# EAGLE board BEP32_6stencil_Seed_wMilling (EAGLE 6.4), part 1 of 8
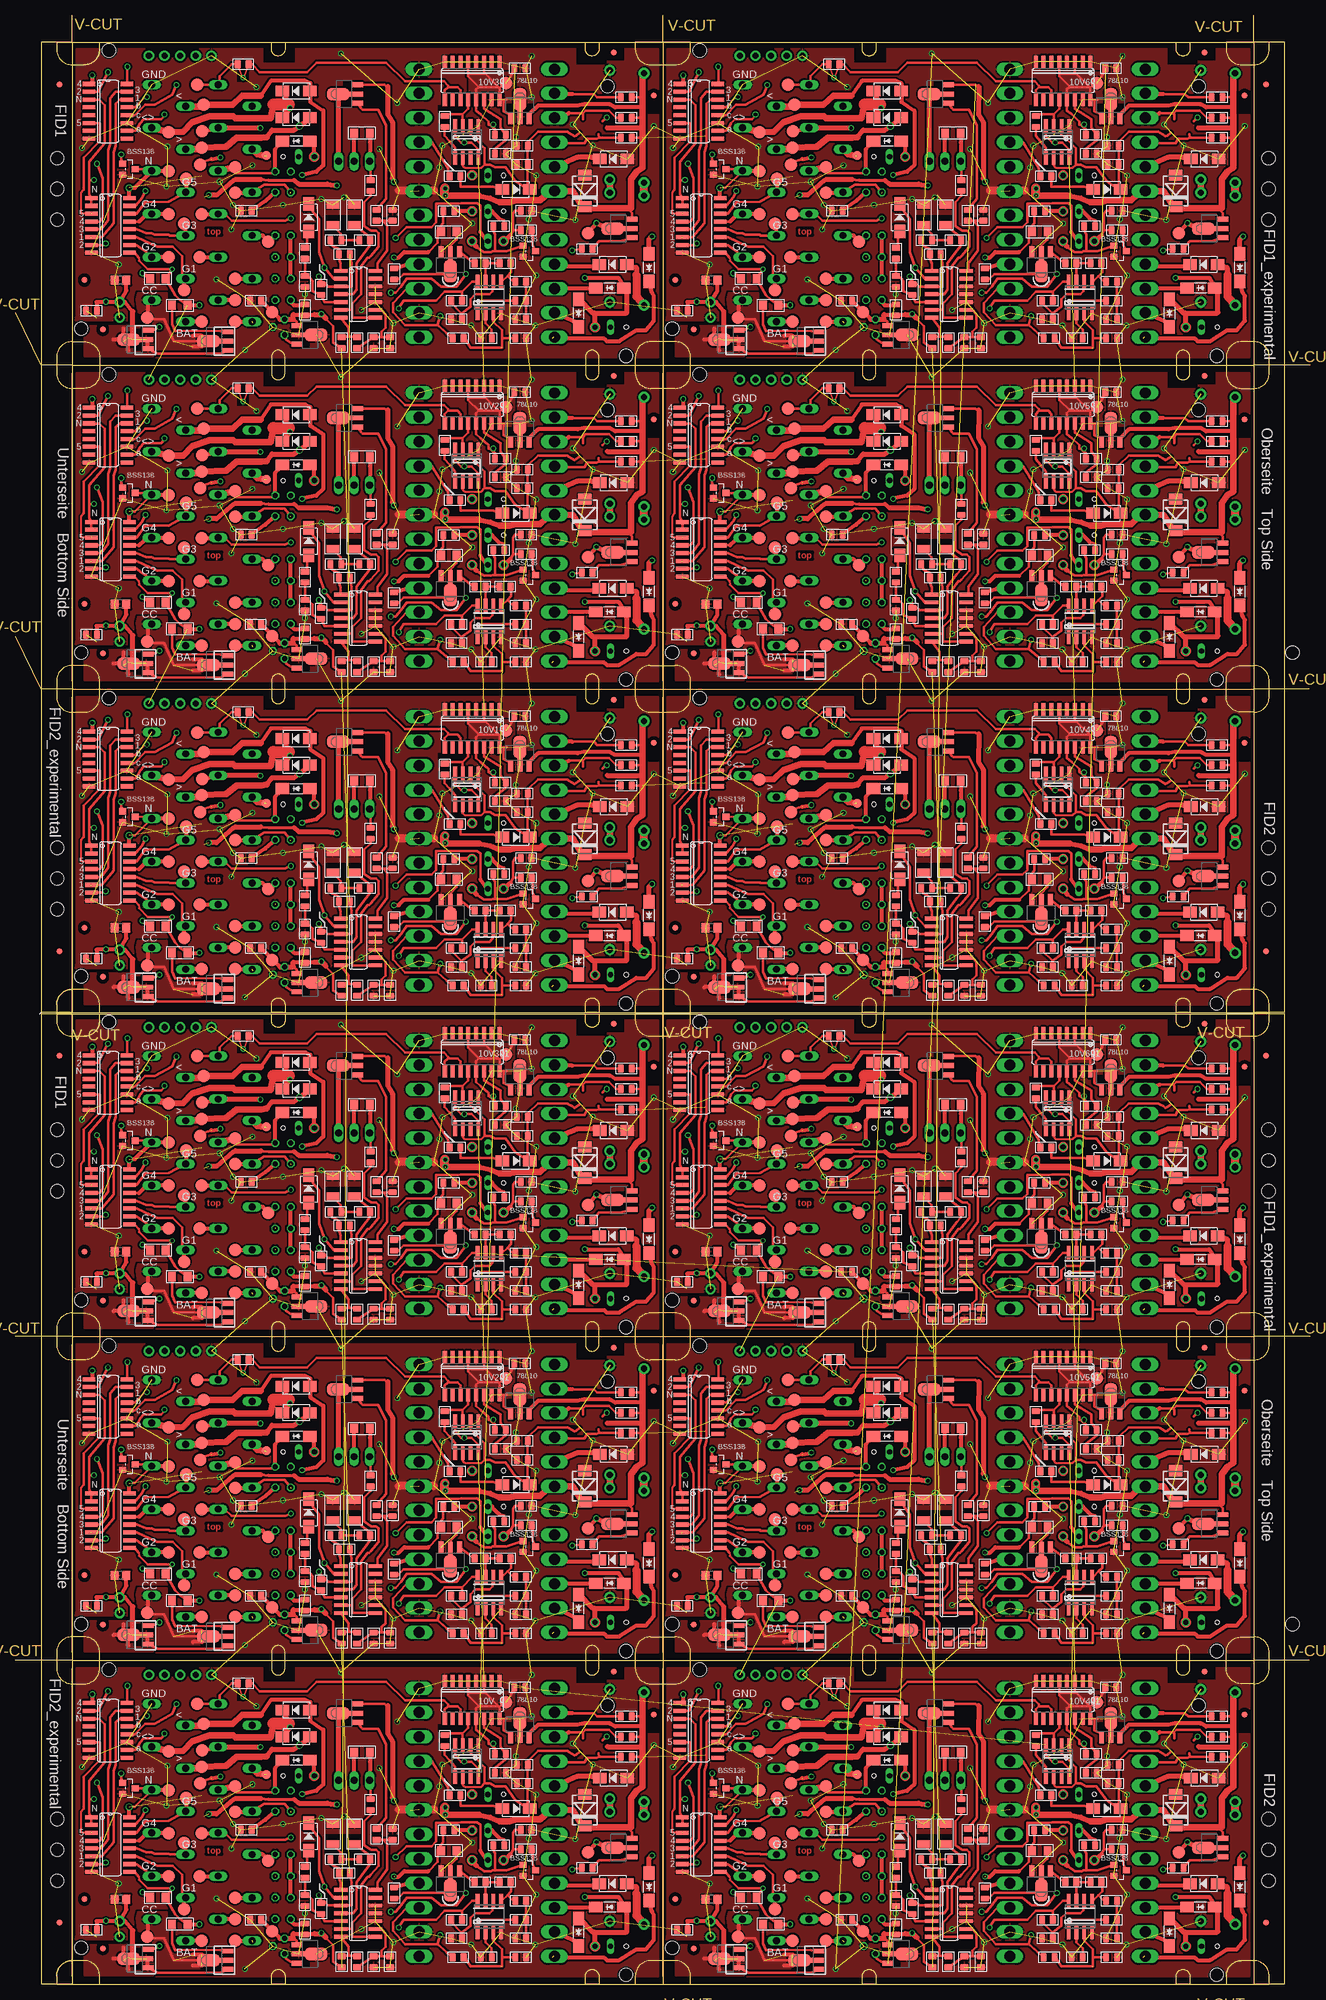
[diagram p24: board, top side]
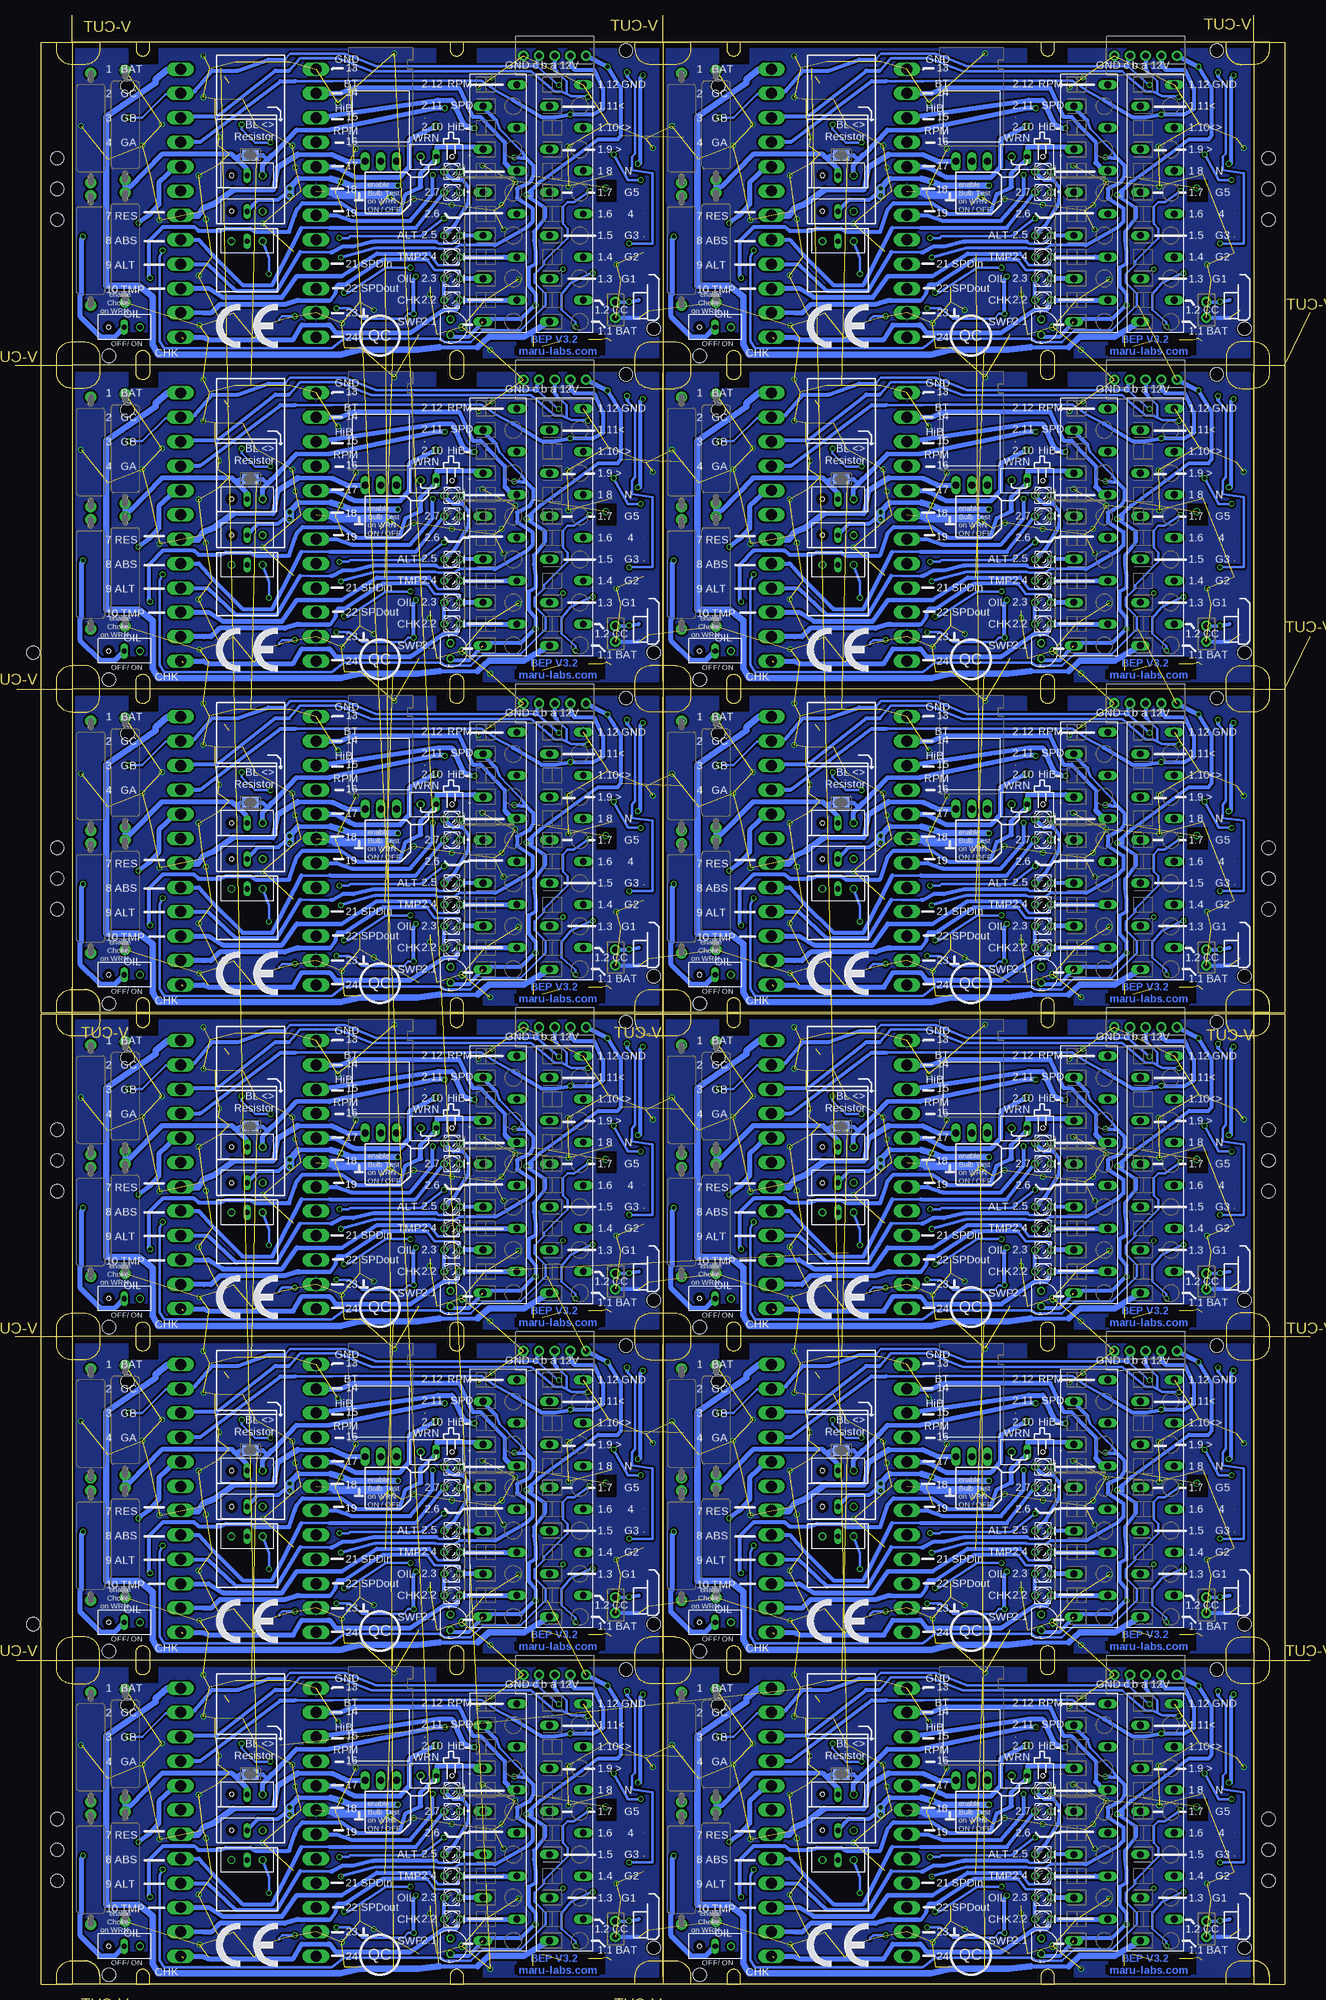
[diagram p25: board, bottom side, seen from below]

Size 210.4 x 319.8 mm. Coordinates in mm from the lower left corner, seen from the top.
Outline: 87 segments
Copper layers (1*16): Top 0.035mm / dielectric 1.5mm / Bottom 0.035mm
Design rules "Vorlage BEP3 und hoeher multi-cb_035um-cu": minimum track width 6mil, minimum drill 12mil, track to track 12mil, track to pad 12mil, pad to pad 6mil, via to via 6mil, smd to smd 6mil, copper to edge 10mil, drill to drill 8mil, minimum pad ring 8mil, minimum via ring 6mil, stop-mask expansion 3mil, vias tented up to drill 0mil, thermal gap 8mil
Holes 2.18 mm at 10.7,5.9 96.2,45.3 10.7,58.5 96.2,97.9 10.7,111.1 96.2,150.5 106.7,5.9 192.2,45.3 106.7,58.5 192.2,97.9 106.7,111.1 192.2,150.5 195.2,1.5 111.2,51.1 99.2,1.5 15.2,51.1 99.2,54.1 195.2,54.1 111.2,103.7 15.2,103.7 99.2,106.7 15.2,156.3 111.2,156.3 195.2,106.7 6.8,138.8 6.8,16.8 6.8,21.8 6.8,133.8 207.5,58.5 203.6,138.8 203.6,16.8 203.6,21.8 203.6,133.8 6.8,26.8 6.8,128.8 203.6,128.8 203.6,26.8 10.7,163.7 96.2,203.1 10.7,216.3 96.2,255.7 10.7,268.9 96.2,308.3 106.7,163.7 192.2,203.1 106.7,216.3 192.2,255.7 106.7,268.9 192.2,308.3 195.2,159.3 111.2,208.9 99.2,159.3 15.2,208.9 99.2,211.9 195.2,211.9 111.2,261.5 15.2,261.5 99.2,264.5 15.2,314.1 111.2,314.1 195.2,264.5 6.8,296.6 6.8,174.6 6.8,179.6 6.8,291.6 207.5,216.3 203.6,296.6 203.6,174.6 203.6,179.6 203.6,291.6 6.8,184.6 6.8,286.6 203.6,286.6 203.6,184.6
tRestrict: area 50.2,21 to 56.7,24.3; area 36,46 to 37.9,47.3; area 67.6,16.6 to 69.4,18.6; area 53.3,41.9 to 54.7,46.2; area 46.5,2.7 to 47.8,7.2; area 47.8,5.9 to 50.5,7.1; area 19.2,2.4 to 20.6,5.9; area 79.5,41.2 to 84.2,42.5; area 97.6,22.4 to 99.2,23.6; area 90.3,38 to 91.4,38.2; area 102.7,40.8 to 104.6,43; area 95.6,49.5 to 98.9,52.2; 168 more areas
bRestrict: area 18.6,1.6 to 28.8,5.1; area 28.7,1.6 to 33.3,3.1; area 38.5,0.9 to 45,3.1; area 39.5,49.1 to 46,51.5; area 90.8,1.5 to 96.8,5.3; area 16.7,26.5 to 20,30.1; area 91.2,48.9 to 96,51.9; area 18.6,54.2 to 28.8,57.8; area 28.7,54.2 to 33.3,55.7; area 38.5,53.5 to 45,55.7; area 39.5,101.7 to 46,104.1; area 90.8,54.1 to 96.8,57.9; 72 more areas
Milling: 360 lines

## Footprints (pad centres in the part's own frame; a part is rotated, then mirrored left to right if it is on the bottom)
12-PIN = drill 1.118 long: 1 19.25,-2.45; 2 15.75,3.05; 3 12.25,-2.45; 4 8.75,3.05; 5 5.25,-2.45; 6 1.75,3.05; 7 -1.75,-2.45; 8 -5.25,3.05; 9 -8.75,-2.45; 10 -12.25,3.05; 11 -15.75,-2.45; 12 -19.25,3.05
B2.0 = smd 2 x 2: TP 0,0
C1206 = smd 1.27 x 2.032: 1 -1.651,0; 2 1.651,0
C0805 = smd 1.397 x 1.016: 1 0,0.889; 2 0,-0.889
DO-214AC = smd 2.2 x 1.77: 1 -2.242,0; 2 2.242,0
DO-214AC_SLIM = smd 2.2 x 1.77: 1 -2.242,0; 2 2.242,0
DO214AA = smd 1.8 x 2.2: A 2.55,0; C -2.55,0
FIDUCIAL_1MM = smd 1 x 1: 1 0,0
FIDUCIAL_1MM_WITH_SOLDERMASK = smd 1 x 1: 1 0,0
SO16 = smd 0.66 x 2.032: 1 -4.445,-3.073; 2 -3.175,-3.073; 3 -1.905,-3.073; 4 -0.635,-3.073; 5 0.635,-3.073; 6 1.905,-3.073; 7 3.175,-3.073; 8 4.445,-3.073; 9 4.445,3.073; 10 3.175,3.073; 11 1.905,3.073; 12 0.635,3.073; 13 -0.635,3.073; 14 -1.905,3.073; 15 -3.175,3.073; 16 -4.445,3.073
78LXX = drill 0.813 octagon: GND 0,1.905; IN 1.27,0; OUT -1.27,0
TO220H_NOHOLE = drill 1.118 long: 1 -2.54,-10.16; 2 0,-10.16; 3 2.54,-10.16
SO14 = smd 0.6 x 2.2: 1 -3.81,-2.8; 2 -2.54,-2.8; 3 -1.27,-2.8; 4 0,-2.8; 5 1.27,-2.8; 6 2.54,-2.8; 7 3.81,-2.8; 8 3.81,2.8; 9 2.54,2.8; 10 1.27,2.8; 11 0,2.8; 12 -1.27,2.8; 13 -2.54,2.8; 14 -3.81,2.8
SOT89_ROUND = smd 0.8 x 1.8: 1 -1.499,-2.181; 3 1.499,-2.181 | smd 0.8 x 2.3: 2 0,-1.927 | smd 2.032 x 3.65: 2@1 0,0.94
SO08 = smd 0.6 x 2.2: 1 -1.905,-2.6; 2 -0.635,-2.6; 3 0.635,-2.6; 4 1.905,-2.6; 5 1.905,2.6; 6 0.635,2.6; 7 -0.635,2.6; 8 -1.905,2.6
JP2_SMALLPADS = drill 0.85: 1 -2.54,0 | drill 0.85 long: 2 0,0 | hole 0.7: 2.54,0
JP2_ORIG_SMALLPADS = drill 0.85: 1 -2.54,0; 3 2.54,0 | drill 0.85 long: 2 0,0
LD260 = drill 0.813 octagon: A -1.27,0; K 1.27,0
SOT89 = smd 0.8 x 1.8: 1 -1.499,-2.181; 3 1.499,-2.181 | smd 0.8 x 2.3: 2 0,-1.927 | smd 2.032 x 3.65: 2@1 0,0.94
SOT-23 = smd 1.016 x 1.143: 1 -0.889,-1.016; 2 0.889,-1.016; 3 0,1.016
V235/17_1MM = drill 1 pad 1.778: 1 -8.89,0; 2 8.89,0
R1206 = smd 1.27 x 1.524: 1 -1.27,0; 2 1.27,0
R0805 = smd 1.397 x 1.016: 1 0,0.889; 2 0,-0.889
R0805' = smd 1.3 x 1.5: 1 -0.95,0; 2 0.95,0
SJ = smd 1.2 x 1.6: 1 -0.725,0; 2 0.725,0
B1,27 = smd 1.5 x 1.5: TP 0,0
24-PIN_V2 = drill 1.778 long: 1 -21.78,-11; 2 -17.82,-11; 3 -13.86,-11; 4 -9.9,-11; 5 -5.94,-11; 6 -1.98,-11; 7 1.98,-11; 8 5.94,-11; 9 9.9,-11; 10 13.86,-11; 11 17.82,-11; 12 21.78,-11; 13 -21.78,11; 14 -17.82,11; 15 -13.86,11; 16 -9.9,11; 17 -5.94,11; 18 -1.98,11; 19 1.98,11; 20 5.94,11; 21 9.9,11; 22 13.86,11; 23 17.82,11; 24 21.78,11
22-23-2051 = drill 1 pad 1.676: 1 -5.08,0; 2 -2.54,0; 3 0,0; 4 2.54,0; 5 5.08,0
22-23-2021 = drill 1 pad 1.676: 1 -1.27,0; 2 1.27,0

## Placement (x,y rotation side)
1  [12-PIN]  25.19,26.3 270 bottom
2  [12-PIN]  35.98,26.3 270 bottom
3  [12-PIN]  25.19,78.9 270 bottom
4  [12-PIN]  35.98,78.9 270 bottom
5  [12-PIN]  25.19,131.5 270 bottom
6  [12-PIN]  35.98,131.5 270 bottom
6V  TPSB2.0  [B2.0]  41.7,8.58 0 top
6V1  TPSB2.0  [B2.0]  41.7,166.38 0 top
6V2  TPSB2.0  [B2.0]  41.7,218.98 0 top
6V3  TPSB2.0  [B2.0]  41.7,271.58 0 top
6V4  TPSB2.0  [B2.0]  137.7,166.38 0 top
6V5  TPSB2.0  [B2.0]  137.7,218.98 0 top
6V6  TPSB2.0  [B2.0]  137.7,271.58 0 top
6V201  TPSB2.0  [B2.0]  41.7,61.18 0 top
6V301  TPSB2.0  [B2.0]  41.7,113.78 0 top
6V401  TPSB2.0  [B2.0]  137.7,8.58 0 top
6V501  TPSB2.0  [B2.0]  137.7,61.18 0 top
6V601  TPSB2.0  [B2.0]  137.7,113.78 0 top
7  [12-PIN]  25.19,184.1 270 bottom
8  [12-PIN]  35.98,184.1 270 bottom
9  [12-PIN]  25.19,236.7 270 bottom
10  [12-PIN]  35.98,236.7 270 bottom
10V  TPSB2.0  [B2.0]  79.7,45.8 0 top
10V1  TPSB2.0  [B2.0]  79.7,203.6 0 top
10V2  TPSB2.0  [B2.0]  79.7,256.2 0 top
10V3  TPSB2.0  [B2.0]  79.7,308.8 0 top
10V4  TPSB2.0  [B2.0]  175.7,203.6 0 top
10V5  TPSB2.0  [B2.0]  175.7,256.2 0 top
10V6  TPSB2.0  [B2.0]  175.7,308.8 0 top
10V201  TPSB2.0  [B2.0]  79.7,98.4 0 top
10V301  TPSB2.0  [B2.0]  79.7,151 0 top
10V401  TPSB2.0  [B2.0]  175.7,45.8 0 top
10V501  TPSB2.0  [B2.0]  175.7,98.4 0 top
10V601  TPSB2.0  [B2.0]  175.7,151 0 top
11  [12-PIN]  25.19,289.3 270 bottom
12  [12-PIN]  35.98,289.3 270 bottom
13  [12-PIN]  121.19,26.3 270 bottom
14  [12-PIN]  131.98,26.3 270 bottom
15  [12-PIN]  121.19,78.9 270 bottom
16  [12-PIN]  131.98,78.9 270 bottom
17  [12-PIN]  121.19,131.5 270 bottom
18  [12-PIN]  131.98,131.5 270 bottom
19  [12-PIN]  121.19,184.1 270 bottom
20  [12-PIN]  131.98,184.1 270 bottom
21  [12-PIN]  121.19,236.7 270 bottom
22  [12-PIN]  131.98,236.7 270 bottom
23  [12-PIN]  121.19,289.3 270 bottom
24  [12-PIN]  131.98,289.3 270 bottom
C1  100u  [C1206]  51.54,182.19 90 top
C2  100u  [C1206]  55.1,182.19 90 top
C3  100nF,  [C0805]  39.03,168.28 270 top
C4  4.7u  [C0805]  82.09,162.19 90 top
C5  100nF.  [C0805]  58.21,161.43 0 top
C6  100nF.  [C0805]  61.26,182.13 0 top
C7  2.2nF  [C0805]  82.34,190.38 90 top
C8  100nF  [C0805]  81.96,206 90 top
C9  100nF  [C0805]  78.78,192.16 90 top
C10  100nF,  [C0805]  82.09,165.24 270 top
C11  100u  [C1206]  51.54,234.79 90 top
C12  100u  [C1206]  55.1,234.79 90 top
C13  100nF,  [C0805]  39.03,220.88 270 top
C14  4.7u  [C0805]  82.09,214.79 90 top
C15  100nF.  [C0805]  58.21,214.03 0 top
C16  100nF.  [C0805]  61.26,234.73 0 top
C17  2.2nF  [C0805]  82.34,242.98 90 top
C18  100nF  [C0805]  81.96,258.6 90 top
C19  100nF  [C0805]  78.78,244.76 90 top
C20  100nF,  [C0805]  82.09,217.84 270 top
C21  100u  [C1206]  51.54,287.39 90 top
C22  100u  [C1206]  55.1,287.39 90 top
C23  100nF,  [C0805]  39.03,273.48 270 top
C24  4.7u  [C0805]  82.09,267.39 90 top
C25  100nF.  [C0805]  58.21,266.63 0 top
C26  100nF.  [C0805]  61.26,287.33 0 top
C27  2.2nF  [C0805]  82.34,295.58 90 top
C28  100nF  [C0805]  81.96,311.2 90 top
C29  100nF  [C0805]  78.78,297.36 90 top
C30  100nF,  [C0805]  82.09,270.44 270 top
C31  100u  [C1206]  147.54,182.19 90 top
C32  100u  [C1206]  151.1,182.19 90 top
C33  100nF,  [C0805]  135.03,168.28 270 top
C34  4.7u  [C0805]  178.09,162.19 90 top
C35  100nF.  [C0805]  154.21,161.43 0 top
C36  100nF.  [C0805]  157.26,182.13 0 top
C37  2.2nF  [C0805]  178.34,190.38 90 top
C38  100nF  [C0805]  177.96,206 90 top
C39  100nF  [C0805]  174.78,192.16 90 top
C40  100nF,  [C0805]  178.09,165.24 270 top
C41  100u  [C1206]  147.54,234.79 90 top
C42  100u  [C1206]  151.1,234.79 90 top
C43  100nF,  [C0805]  135.03,220.88 270 top
C44  4.7u  [C0805]  178.09,214.79 90 top
C45  100nF.  [C0805]  154.21,214.03 0 top
C46  100nF.  [C0805]  157.26,234.73 0 top
C47  2.2nF  [C0805]  178.34,242.98 90 top
C48  100nF  [C0805]  177.96,258.6 90 top
C49  100nF  [C0805]  174.78,244.76 90 top
C50  100nF,  [C0805]  178.09,217.84 270 top
C51  100u  [C1206]  147.54,287.39 90 top
C52  100u  [C1206]  151.1,287.39 90 top
C53  100nF,  [C0805]  135.03,273.48 270 top
C54  4.7u  [C0805]  178.09,267.39 90 top
C55  100nF.  [C0805]  154.21,266.63 0 top
C56  100nF.  [C0805]  157.26,287.33 0 top
C57  2.2nF  [C0805]  178.34,295.58 90 top
C58  100nF  [C0805]  177.96,311.2 90 top
C59  100nF  [C0805]  174.78,297.36 90 top
C60  100nF,  [C0805]  178.09,270.44 270 top
C101  4.7u  [C0805]  82.09,4.39 90 top
C102  100nF  [C0805]  81.96,48.2 90 top
C103  100nF,  [C0805]  82.09,7.44 270 top
C104  100nF,  [C0805]  39.03,10.48 270 top
C105  100nF.  [C0805]  58.21,3.63 0 top
C106  100nF.  [C0805]  61.26,24.33 0 top
C107  100u  [C1206]  51.54,24.39 90 top
C108  100u  [C1206]  55.1,24.39 90 top
C109  2.2nF  [C0805]  82.34,32.58 90 top
C110  100nF  [C0805]  78.78,34.36 90 top
C201  4.7u  [C0805]  82.09,56.99 90 top
C202  100nF  [C0805]  81.96,100.8 90 top
C203  100nF,  [C0805]  82.09,60.04 270 top
C204  100nF,  [C0805]  39.03,63.08 270 top
C205  100nF.  [C0805]  58.21,56.23 0 top
C206  100nF.  [C0805]  61.26,76.93 0 top
C207  100u  [C1206]  51.54,76.99 90 top
C208  100u  [C1206]  55.1,76.99 90 top
C209  2.2nF  [C0805]  82.34,85.18 90 top
C210  100nF  [C0805]  78.78,86.96 90 top
C301  4.7u  [C0805]  82.09,109.59 90 top
C302  100nF  [C0805]  81.96,153.4 90 top
C303  100nF,  [C0805]  82.09,112.64 270 top
C304  100nF,  [C0805]  39.03,115.68 270 top
C305  100nF.  [C0805]  58.21,108.83 0 top
C306  100nF.  [C0805]  61.26,129.53 0 top
C307  100u  [C1206]  51.54,129.59 90 top
C308  100u  [C1206]  55.1,129.59 90 top
C309  2.2nF  [C0805]  82.34,137.78 90 top
C310  100nF  [C0805]  78.78,139.56 90 top
C401  4.7u  [C0805]  178.09,4.39 90 top
C402  100nF  [C0805]  177.96,48.2 90 top
C403  100nF,  [C0805]  178.09,7.44 270 top
C404  100nF,  [C0805]  135.03,10.48 270 top
C405  100nF.  [C0805]  154.21,3.63 0 top
C406  100nF.  [C0805]  157.26,24.33 0 top
C407  100u  [C1206]  147.54,24.39 90 top
C408  100u  [C1206]  151.1,24.39 90 top
C409  2.2nF  [C0805]  178.34,32.58 90 top
C410  100nF  [C0805]  174.78,34.36 90 top
C501  4.7u  [C0805]  178.09,56.99 90 top
C502  100nF  [C0805]  177.96,100.8 90 top
C503  100nF,  [C0805]  178.09,60.04 270 top
C504  100nF,  [C0805]  135.03,63.08 270 top
C505  100nF.  [C0805]  154.21,56.23 0 top
C506  100nF.  [C0805]  157.26,76.93 0 top
C507  100u  [C1206]  147.54,76.99 90 top
C508  100u  [C1206]  151.1,76.99 90 top
C509  2.2nF  [C0805]  178.34,85.18 90 top
C510  100nF  [C0805]  174.78,86.96 90 top
C601  4.7u  [C0805]  178.09,109.59 90 top
C602  100nF  [C0805]  177.96,153.4 90 top
C603  100nF,  [C0805]  178.09,112.64 270 top
C604  100nF,  [C0805]  135.03,115.68 270 top
C605  100nF.  [C0805]  154.21,108.83 0 top
C606  100nF.  [C0805]  157.26,129.53 0 top
C607  100u  [C1206]  147.54,129.59 90 top
C608  100u  [C1206]  151.1,129.59 90 top
C609  2.2nF  [C0805]  178.34,137.78 90 top
C610  100nF  [C0805]  174.78,139.56 90 top
D1  1N4007  [DO-214AC]  47.67,181.75 90 top
D2  1N4007,  [DO-214AC]  45.64,198 180 top
D3  1N4007,  [DO-214AC]  45.64,202.32 180 top
D4  1N4007.  [DO-214AC]  97.07,174.13 180 top
D5  1N5817  [DO-214AC_SLIM]  96.56,170.32 180 top
D6  1N5817.  [DO-214AC_SLIM]  91.5,166.24 270 top
D7  1N5817.  [DO-214AC_SLIM]  102.93,173.61 270 top
D8  1N5817  [DO-214AC_SLIM]  45.64,194.19 180 top
D9  1N4007.  [DO-214AC]  97.2,191.27 180 top
D10  1N4007  [DO-214AC]  81.32,186.32 0 top
D11  SM6T  [DO214AA]  92.5,186.06 90 top
D12  1N4007  [DO-214AC]  47.67,234.35 90 top
D13  1N4007,  [DO-214AC]  45.64,250.6 180 top
D14  1N4007,  [DO-214AC]  45.64,254.92 180 top
D15  1N4007.  [DO-214AC]  97.07,226.73 180 top
D16  1N5817  [DO-214AC_SLIM]  96.56,222.92 180 top
D17  1N5817.  [DO-214AC_SLIM]  91.5,218.84 270 top
D18  1N5817.  [DO-214AC_SLIM]  102.93,226.21 270 top
D19  1N5817  [DO-214AC_SLIM]  45.64,246.79 180 top
D20  1N4007.  [DO-214AC]  97.2,243.87 180 top
D21  1N4007  [DO-214AC]  81.32,238.92 0 top
D22  SM6T  [DO214AA]  92.5,238.66 90 top
D23  1N4007  [DO-214AC]  47.67,286.95 90 top
D24  1N4007,  [DO-214AC]  45.64,303.2 180 top
D25  1N4007,  [DO-214AC]  45.64,307.52 180 top
D26  1N4007.  [DO-214AC]  97.07,279.33 180 top
D27  1N5817  [DO-214AC_SLIM]  96.56,275.52 180 top
D28  1N5817.  [DO-214AC_SLIM]  91.5,271.44 270 top
D29  1N5817.  [DO-214AC_SLIM]  102.93,278.81 270 top
D30  1N5817  [DO-214AC_SLIM]  45.64,299.39 180 top
D31  1N4007.  [DO-214AC]  97.2,296.47 180 top
D32  1N4007  [DO-214AC]  81.32,291.52 0 top
D33  SM6T  [DO214AA]  92.5,291.26 90 top
D34  1N4007  [DO-214AC]  143.67,181.75 90 top
D35  1N4007,  [DO-214AC]  141.64,198 180 top
D36  1N4007,  [DO-214AC]  141.64,202.32 180 top
D37  1N4007.  [DO-214AC]  193.07,174.13 180 top
D38  1N5817  [DO-214AC_SLIM]  192.56,170.32 180 top
D39  1N5817.  [DO-214AC_SLIM]  187.5,166.24 270 top
D40  1N5817.  [DO-214AC_SLIM]  198.93,173.61 270 top
D41  1N5817  [DO-214AC_SLIM]  141.64,194.19 180 top
D42  1N4007.  [DO-214AC]  193.2,191.27 180 top
D43  1N4007  [DO-214AC]  177.32,186.32 0 top
D44  SM6T  [DO214AA]  188.5,186.06 90 top
D45  1N4007  [DO-214AC]  143.67,234.35 90 top
D46  1N4007,  [DO-214AC]  141.64,250.6 180 top
D47  1N4007,  [DO-214AC]  141.64,254.92 180 top
D48  1N4007.  [DO-214AC]  193.07,226.73 180 top
D49  1N5817  [DO-214AC_SLIM]  192.56,222.92 180 top
D50  1N5817.  [DO-214AC_SLIM]  187.5,218.84 270 top
D51  1N5817.  [DO-214AC_SLIM]  198.93,226.21 270 top
D52  1N5817  [DO-214AC_SLIM]  141.64,246.79 180 top
D53  1N4007.  [DO-214AC]  193.2,243.87 180 top
D54  1N4007  [DO-214AC]  177.32,238.92 0 top
D55  SM6T  [DO214AA]  188.5,238.66 90 top
D56  1N4007  [DO-214AC]  143.67,286.95 90 top
D57  1N4007,  [DO-214AC]  141.64,303.2 180 top
D58  1N4007,  [DO-214AC]  141.64,307.52 180 top
D59  1N4007.  [DO-214AC]  193.07,279.33 180 top
D60  1N5817  [DO-214AC_SLIM]  192.56,275.52 180 top
D61  1N5817.  [DO-214AC_SLIM]  187.5,271.44 270 top
D62  1N5817.  [DO-214AC_SLIM]  198.93,278.81 270 top
D63  1N5817  [DO-214AC_SLIM]  141.64,299.39 180 top
D64  1N4007.  [DO-214AC]  193.2,296.47 180 top
D65  1N4007  [DO-214AC]  177.32,291.52 0 top
D66  SM6T  [DO214AA]  188.5,291.26 90 top
D101  SM6T  [DO214AA]  92.5,28.26 90 top
D102  1N4007,  [DO-214AC]  45.64,40.2 180 top
D103  1N4007,  [DO-214AC]  45.64,44.52 180 top
D105  1N4007.  [DO-214AC]  97.2,33.47 180 top
D106  1N4007.  [DO-214AC]  97.07,16.33 180 top
D107  1N5817  [DO-214AC_SLIM]  96.56,12.52 180 top
D108  1N5817.  [DO-214AC_SLIM]  91.5,8.44 270 top
D109  1N5817.  [DO-214AC_SLIM]  102.93,15.81 270 top
D110  1N5817  [DO-214AC_SLIM]  45.64,36.39 180 top
D111  1N4007  [DO-214AC]  47.67,23.95 90 top
D112  1N4007  [DO-214AC]  81.32,28.52 0 top
D201  SM6T  [DO214AA]  92.5,80.86 90 top
D202  1N4007,  [DO-214AC]  45.64,92.8 180 top
D203  1N4007,  [DO-214AC]  45.64,97.12 180 top
D205  1N4007.  [DO-214AC]  97.2,86.07 180 top
D206  1N4007.  [DO-214AC]  97.07,68.93 180 top
D207  1N5817  [DO-214AC_SLIM]  96.56,65.12 180 top
D208  1N5817.  [DO-214AC_SLIM]  91.5,61.04 270 top
D209  1N5817.  [DO-214AC_SLIM]  102.93,68.41 270 top
D210  1N5817  [DO-214AC_SLIM]  45.64,88.99 180 top
D211  1N4007  [DO-214AC]  47.67,76.55 90 top
D212  1N4007  [DO-214AC]  81.32,81.12 0 top
D301  SM6T  [DO214AA]  92.5,133.46 90 top
D302  1N4007,  [DO-214AC]  45.64,145.4 180 top
D303  1N4007,  [DO-214AC]  45.64,149.72 180 top
D305  1N4007.  [DO-214AC]  97.2,138.67 180 top
D306  1N4007.  [DO-214AC]  97.07,121.53 180 top
D307  1N5817  [DO-214AC_SLIM]  96.56,117.72 180 top
D308  1N5817.  [DO-214AC_SLIM]  91.5,113.64 270 top
D309  1N5817.  [DO-214AC_SLIM]  102.93,121.01 270 top
D310  1N5817  [DO-214AC_SLIM]  45.64,141.59 180 top
D311  1N4007  [DO-214AC]  47.67,129.15 90 top
D312  1N4007  [DO-214AC]  81.32,133.72 0 top
D401  SM6T  [DO214AA]  188.5,28.26 90 top
D402  1N4007,  [DO-214AC]  141.64,40.2 180 top
D403  1N4007,  [DO-214AC]  141.64,44.52 180 top
D405  1N4007.  [DO-214AC]  193.2,33.47 180 top
D406  1N4007.  [DO-214AC]  193.07,16.33 180 top
D407  1N5817  [DO-214AC_SLIM]  192.56,12.52 180 top
D408  1N5817.  [DO-214AC_SLIM]  187.5,8.44 270 top
D409  1N5817.  [DO-214AC_SLIM]  198.93,15.81 270 top
D410  1N5817  [DO-214AC_SLIM]  141.64,36.39 180 top
D411  1N4007  [DO-214AC]  143.67,23.95 90 top
D412  1N4007  [DO-214AC]  177.32,28.52 0 top
D501  SM6T  [DO214AA]  188.5,80.86 90 top
D502  1N4007,  [DO-214AC]  141.64,92.8 180 top
D503  1N4007,  [DO-214AC]  141.64,97.12 180 top
D505  1N4007.  [DO-214AC]  193.2,86.07 180 top
D506  1N4007.  [DO-214AC]  193.07,68.93 180 top
D507  1N5817  [DO-214AC_SLIM]  192.56,65.12 180 top
D508  1N5817.  [DO-214AC_SLIM]  187.5,61.04 270 top
D509  1N5817.  [DO-214AC_SLIM]  198.93,68.41 270 top
D510  1N5817  [DO-214AC_SLIM]  141.64,88.99 180 top
D511  1N4007  [DO-214AC]  143.67,76.55 90 top
D512  1N4007  [DO-214AC]  177.32,81.12 0 top
D601  SM6T  [DO214AA]  188.5,133.46 90 top
D602  1N4007,  [DO-214AC]  141.64,145.4 180 top
D603  1N4007,  [DO-214AC]  141.64,149.72 180 top
D605  1N4007.  [DO-214AC]  193.2,138.67 180 top
D606  1N4007.  [DO-214AC]  193.07,121.53 180 top
D607  1N5817  [DO-214AC_SLIM]  192.56,117.72 180 top
D608  1N5817.  [DO-214AC_SLIM]  187.5,113.64 270 top
D609  1N5817.  [DO-214AC_SLIM]  198.93,121.01 270 top
D610  1N5817  [DO-214AC_SLIM]  141.64,141.59 180 top
D611  1N4007  [DO-214AC]  143.67,129.15 90 top
D612  1N4007  [DO-214AC]  177.32,133.72 0 top
FID1  FIDUCIAL  [FIDUCIAL_1MM]  7.2,150.8 0 top
FID1B  FIDUCIALFIDUCIAL_1MM_WITH_SOLDERMASK  [FIDUCIAL_1MM_WITH_SOLDERMASK]  203.2,150.8 0 top
FID1B1  FIDUCIALFIDUCIAL_1MM_WITH_SOLDERMASK  [FIDUCIAL_1MM_WITH_SOLDERMASK]  203.2,308.6 0 top
FID2  FIDUCIAL  [FIDUCIAL_1MM]  203.2,10 0 top
FID2B  FIDUCIALFIDUCIAL_1MM_WITH_SOLDERMASK  [FIDUCIAL_1MM_WITH_SOLDERMASK]  7.2,10 0 top
FID2B1  FIDUCIALFIDUCIAL_1MM_WITH_SOLDERMASK  [FIDUCIAL_1MM_WITH_SOLDERMASK]  7.2,167.8 0 top
FID3  FIDUCIAL  [FIDUCIAL_1MM]  97.2,208.6 0 top
FID4  FIDUCIAL  [FIDUCIAL_1MM]  11.2,171.6 0 top
FID5  FIDUCIAL  [FIDUCIAL_1MM]  14.2,163.6 0 top
FID6  FIDUCIAL  [FIDUCIAL_1MM]  103.7,201.6 0 top
FID7  FIDUCIAL  [FIDUCIAL_1MM]  97.2,261.2 0 top
FID8  FIDUCIAL  [FIDUCIAL_1MM]  11.2,224.2 0 top
FID9  FIDUCIAL  [FIDUCIAL_1MM]  14.2,216.2 0 top
FID10  FIDUCIAL  [FIDUCIAL_1MM]  103.7,254.2 0 top
FID11  FIDUCIAL  [FIDUCIAL_1MM]  97.2,313.8 0 top
FID12  FIDUCIAL  [FIDUCIAL_1MM]  11.2,276.8 0 top
FID13  FIDUCIAL  [FIDUCIAL_1MM]  14.2,268.8 0 top
FID14  FIDUCIAL  [FIDUCIAL_1MM]  103.7,306.8 0 top
FID15  FIDUCIAL  [FIDUCIAL_1MM]  193.2,208.6 0 top
FID16  FIDUCIAL  [FIDUCIAL_1MM]  107.2,171.6 0 top
FID17  FIDUCIAL  [FIDUCIAL_1MM]  110.2,163.6 0 top
FID18  FIDUCIAL  [FIDUCIAL_1MM]  199.7,201.6 0 top
FID19  FIDUCIAL  [FIDUCIAL_1MM]  193.2,261.2 0 top
FID20  FIDUCIAL  [FIDUCIAL_1MM]  107.2,224.2 0 top
FID21  FIDUCIAL  [FIDUCIAL_1MM]  110.2,216.2 0 top
FID22  FIDUCIAL  [FIDUCIAL_1MM]  199.7,254.2 0 top
FID23  FIDUCIAL  [FIDUCIAL_1MM]  193.2,313.8 0 top
FID24  FIDUCIAL  [FIDUCIAL_1MM]  107.2,276.8 0 top
FID25  FIDUCIAL  [FIDUCIAL_1MM]  110.2,268.8 0 top
FID26  FIDUCIAL  [FIDUCIAL_1MM]  199.7,306.8 0 top
FID27  FIDUCIAL  [FIDUCIAL_1MM]  7.2,308.6 0 top
FID28  FIDUCIAL  [FIDUCIAL_1MM]  203.2,167.8 0 top
FID101  FIDUCIAL  [FIDUCIAL_1MM]  97.2,50.8 0 top
FID102  FIDUCIAL  [FIDUCIAL_1MM]  11.2,13.8 0 top
FID103  FIDUCIAL  [FIDUCIAL_1MM]  14.2,5.8 0 top
FID104  FIDUCIAL  [FIDUCIAL_1MM]  103.7,43.8 0 top
FID201  FIDUCIAL  [FIDUCIAL_1MM]  97.2,103.4 0 top
FID202  FIDUCIAL  [FIDUCIAL_1MM]  11.2,66.4 0 top
FID203  FIDUCIAL  [FIDUCIAL_1MM]  14.2,58.4 0 top
FID204  FIDUCIAL  [FIDUCIAL_1MM]  103.7,96.4 0 top
FID301  FIDUCIAL  [FIDUCIAL_1MM]  97.2,156 0 top
FID302  FIDUCIAL  [FIDUCIAL_1MM]  11.2,119 0 top
FID303  FIDUCIAL  [FIDUCIAL_1MM]  14.2,111 0 top
FID304  FIDUCIAL  [FIDUCIAL_1MM]  103.7,149 0 top
FID401  FIDUCIAL  [FIDUCIAL_1MM]  193.2,50.8 0 top
FID402  FIDUCIAL  [FIDUCIAL_1MM]  107.2,13.8 0 top
FID403  FIDUCIAL  [FIDUCIAL_1MM]  110.2,5.8 0 top
FID404  FIDUCIAL  [FIDUCIAL_1MM]  199.7,43.8 0 top
FID501  FIDUCIAL  [FIDUCIAL_1MM]  193.2,103.4 0 top
FID502  FIDUCIAL  [FIDUCIAL_1MM]  107.2,66.4 0 top
FID503  FIDUCIAL  [FIDUCIAL_1MM]  110.2,58.4 0 top
FID504  FIDUCIAL  [FIDUCIAL_1MM]  199.7,96.4 0 top
FID601  FIDUCIAL  [FIDUCIAL_1MM]  193.2,156 0 top
FID602  FIDUCIAL  [FIDUCIAL_1MM]  107.2,119 0 top
FID603  FIDUCIAL  [FIDUCIAL_1MM]  110.2,111 0 top
FID604  FIDUCIAL  [FIDUCIAL_1MM]  199.7,149 0 top
IC1  4028  [SO16]  15.03,199.02 270 top
IC2  6V pos  [78LXX]  43.73,163.97 270 bottom
IC3  317TO202H_NOHOLE  [TO220H_NOHOLE]  55.03,201.05 0 bottom
IC4  ULN2004  [SO16]  15.43,180.48 270 top
IC5  LM339  [SO14]  55.67,169.3 270 top
IC6  78L06  [SOT89_ROUND]  47.92,162.7 270 top
IC7  555  [SO08]  73.32,194.06 180 top
IC8  4538  [SO16]  74.21,203.97 180 top
IC9  78L10  [SOT89_ROUND]  81.96,200.03 0 top
IC10  LM2904  [SO08]  77.01,168.79 0 top
IC11  4028  [SO16]  15.03,251.62 270 top
IC12  6V pos  [78LXX]  43.73,216.57 270 bottom
IC13  317TO202H_NOHOLE  [TO220H_NOHOLE]  55.03,253.65 0 bottom
IC14  ULN2004  [SO16]  15.43,233.08 270 top
IC15  LM339  [SO14]  55.67,221.9 270 top
IC16  78L06  [SOT89_ROUND]  47.92,215.3 270 top
IC17  555  [SO08]  73.32,246.67 180 top
IC18  4538  [SO16]  74.21,256.57 180 top
IC19  78L10  [SOT89_ROUND]  81.96,252.63 0 top
IC20  LM2904  [SO08]  77.01,221.39 0 top
IC21  4028  [SO16]  15.03,304.22 270 top
IC22  6V pos  [78LXX]  43.73,269.17 270 bottom
IC23  317TO202H_NOHOLE  [TO220H_NOHOLE]  55.03,306.25 0 bottom
IC24  ULN2004  [SO16]  15.43,285.68 270 top
IC25  LM339  [SO14]  55.67,274.5 270 top
IC26  78L06  [SOT89_ROUND]  47.92,267.9 270 top
IC27  555  [SO08]  73.32,299.26 180 top
IC28  4538  [SO16]  74.21,309.17 180 top
IC29  78L10  [SOT89_ROUND]  81.96,305.23 0 top
IC30  LM2904  [SO08]  77.01,273.99 0 top
IC31  4028  [SO16]  111.03,199.02 270 top
IC32  6V pos  [78LXX]  139.73,163.97 270 bottom
IC33  317TO202H_NOHOLE  [TO220H_NOHOLE]  151.03,201.05 0 bottom
IC34  ULN2004  [SO16]  111.43,180.48 270 top
IC35  LM339  [SO14]  151.67,169.3 270 top
IC36  78L06  [SOT89_ROUND]  143.92,162.7 270 top
IC37  555  [SO08]  169.32,194.06 180 top
IC38  4538  [SO16]  170.21,203.97 180 top
IC39  78L10  [SOT89_ROUND]  177.96,200.03 0 top
IC40  LM2904  [SO08]  173.01,168.79 0 top
IC41  4028  [SO16]  111.03,251.62 270 top
IC42  6V pos  [78LXX]  139.73,216.57 270 bottom
IC43  317TO202H_NOHOLE  [TO220H_NOHOLE]  151.03,253.65 0 bottom
IC44  ULN2004  [SO16]  111.43,233.08 270 top
IC45  LM339  [SO14]  151.67,221.9 270 top
IC46  78L06  [SOT89_ROUND]  143.92,215.3 270 top
IC47  555  [SO08]  169.32,246.67 180 top
IC48  4538  [SO16]  170.21,256.57 180 top
IC49  78L10  [SOT89_ROUND]  177.96,252.63 0 top
IC50  LM2904  [SO08]  173.01,221.39 0 top
IC51  4028  [SO16]  111.03,304.22 270 top
IC52  6V pos  [78LXX]  139.73,269.17 270 bottom
IC53  317TO202H_NOHOLE  [TO220H_NOHOLE]  151.03,306.25 0 bottom
IC54  ULN2004  [SO16]  111.43,285.68 270 top
IC55  LM339  [SO14]  151.67,274.5 270 top
IC56  78L06  [SOT89_ROUND]  143.92,267.9 270 top
IC57  555  [SO08]  169.32,299.26 180 top
IC58  4538  [SO16]  170.21,309.17 180 top
IC59  78L10  [SOT89_ROUND]  177.96,305.23 0 top
IC60  LM2904  [SO08]  173.01,273.99 0 top
IC101  LM2904  [SO08]  77.01,10.99 0 top
IC102  78L06  [SOT89_ROUND]  47.92,4.9 270 top
IC103  6V pos  [78LXX]  43.73,6.17 270 bottom
IC104  78L10  [SOT89_ROUND]  81.96,42.23 0 top
IC105  4028  [SO16]  15.03,41.22 270 top
IC107  ULN2004  [SO16]  15.43,22.68 270 top
IC108  LM339  [SO14]  55.67,11.5 270 top
IC109  317TO202H_NOHOLE  [TO220H_NOHOLE]  55.03,43.25 0 bottom
IC110  555  [SO08]  73.32,36.27 180 top
IC111  4538  [SO16]  74.21,46.17 180 top
IC201  LM2904  [SO08]  77.01,63.59 0 top
IC202  78L06  [SOT89_ROUND]  47.92,57.5 270 top
IC203  6V pos  [78LXX]  43.73,58.77 270 bottom
IC204  78L10  [SOT89_ROUND]  81.96,94.83 0 top
IC205  4028  [SO16]  15.03,93.82 270 top
IC207  ULN2004  [SO16]  15.43,75.28 270 top
IC208  LM339  [SO14]  55.67,64.1 270 top
IC209  317TO202H_NOHOLE  [TO220H_NOHOLE]  55.03,95.85 0 bottom
IC210  555  [SO08]  73.32,88.86 180 top
IC211  4538  [SO16]  74.21,98.77 180 top
IC301  LM2904  [SO08]  77.01,116.19 0 top
IC302  78L06  [SOT89_ROUND]  47.92,110.1 270 top
IC303  6V pos  [78LXX]  43.73,111.37 270 bottom
IC304  78L10  [SOT89_ROUND]  81.96,147.43 0 top
IC305  4028  [SO16]  15.03,146.42 270 top
IC307  ULN2004  [SO16]  15.43,127.88 270 top
IC308  LM339  [SO14]  55.67,116.7 270 top
IC309  317TO202H_NOHOLE  [TO220H_NOHOLE]  55.03,148.45 0 bottom
IC310  555  [SO08]  73.32,141.47 180 top
IC311  4538  [SO16]  74.21,151.37 180 top
IC401  LM2904  [SO08]  173.01,10.99 0 top
IC402  78L06  [SOT89_ROUND]  143.92,4.9 270 top
IC403  6V pos  [78LXX]  139.73,6.17 270 bottom
IC404  78L10  [SOT89_ROUND]  177.96,42.23 0 top
IC405  4028  [SO16]  111.03,41.22 270 top
IC407  ULN2004  [SO16]  111.43,22.68 270 top
IC408  LM339  [SO14]  151.67,11.5 270 top
IC409  317TO202H_NOHOLE  [TO220H_NOHOLE]  151.03,43.25 0 bottom
IC410  555  [SO08]  169.32,36.27 180 top
IC411  4538  [SO16]  170.21,46.17 180 top
IC501  LM2904  [SO08]  173.01,63.59 0 top
IC502  78L06  [SOT89_ROUND]  143.92,57.5 270 top
IC503  6V pos  [78LXX]  139.73,58.77 270 bottom
IC504  78L10  [SOT89_ROUND]  177.96,94.83 0 top
IC505  4028  [SO16]  111.03,93.82 270 top
IC507  ULN2004  [SO16]  111.43,75.28 270 top
IC508  LM339  [SO14]  151.67,64.1 270 top
IC509  317TO202H_NOHOLE  [TO220H_NOHOLE]  151.03,95.85 0 bottom
IC510  555  [SO08]  169.32,88.86 180 top
IC511  4538  [SO16]  170.21,98.77 180 top
IC601  LM2904  [SO08]  173.01,116.19 0 top
IC602  78L06  [SOT89_ROUND]  143.92,110.1 270 top
IC603  6V pos  [78LXX]  139.73,111.37 270 bottom
IC604  78L10  [SOT89_ROUND]  177.96,147.43 0 top
IC605  4028  [SO16]  111.03,146.42 270 top
IC607  ULN2004  [SO16]  111.43,127.88 270 top
IC608  LM339  [SO14]  151.67,116.7 270 top
IC609  317TO202H_NOHOLE  [TO220H_NOHOLE]  151.03,148.45 0 bottom
IC610  555  [SO08]  169.32,141.47 180 top
IC611  4538  [SO16]  170.21,151.37 180 top
JP1  [JP2_SMALLPADS]  76.75,182.76 180 bottom
JP2  JP2E_ORIG  [JP2_ORIG_SMALLPADS]  76.75,177.94 180 bottom
JP3  [JP2_SMALLPADS]  96.7,163.95 180 bottom
JP4  [JP2_SMALLPADS]  46.02,191.65 0 bottom
JP5  [JP2_SMALLPADS]  76.75,188.6 180 bottom
JP6  [JP2_SMALLPADS]  76.75,235.36 180 bottom
JP7  JP2E_ORIG  [JP2_ORIG_SMALLPADS]  76.75,230.54 180 bottom
JP8  [JP2_SMALLPADS]  96.7,216.55 180 bottom
JP9  [JP2_SMALLPADS]  46.02,244.25 0 bottom
JP10  [JP2_SMALLPADS]  76.75,241.2 180 bottom
JP11  [JP2_SMALLPADS]  76.75,287.96 180 bottom
JP12  JP2E_ORIG  [JP2_ORIG_SMALLPADS]  76.75,283.14 180 bottom
JP13  [JP2_SMALLPADS]  96.7,269.15 180 bottom
JP14  [JP2_SMALLPADS]  46.02,296.85 0 bottom
JP15  [JP2_SMALLPADS]  76.75,293.8 180 bottom
JP16  [JP2_SMALLPADS]  172.75,182.76 180 bottom
JP17  JP2E_ORIG  [JP2_ORIG_SMALLPADS]  172.75,177.94 180 bottom
JP18  [JP2_SMALLPADS]  192.7,163.95 180 bottom
JP19  [JP2_SMALLPADS]  142.02,191.65 0 bottom
JP20  [JP2_SMALLPADS]  172.75,188.6 180 bottom
JP21  [JP2_SMALLPADS]  172.75,235.36 180 bottom
JP22  JP2E_ORIG  [JP2_ORIG_SMALLPADS]  172.75,230.54 180 bottom
JP23  [JP2_SMALLPADS]  192.7,216.55 180 bottom
JP24  [JP2_SMALLPADS]  142.02,244.25 0 bottom
JP25  [JP2_SMALLPADS]  172.75,241.2 180 bottom
JP26  [JP2_SMALLPADS]  172.75,287.96 180 bottom
JP27  JP2E_ORIG  [JP2_ORIG_SMALLPADS]  172.75,283.14 180 bottom
JP28  [JP2_SMALLPADS]  192.7,269.15 180 bottom
JP29  [JP2_SMALLPADS]  142.02,296.85 0 bottom
JP30  [JP2_SMALLPADS]  172.75,293.8 180 bottom
JP101  [JP2_SMALLPADS]  76.75,24.96 180 bottom
JP102  [JP2_SMALLPADS]  96.7,6.15 180 bottom
JP103  [JP2_SMALLPADS]  46.02,33.85 0 bottom
JP104  [JP2_SMALLPADS]  76.75,30.8 180 bottom
JP105  JP2E_ORIG  [JP2_ORIG_SMALLPADS]  76.75,20.14 180 bottom
JP201  [JP2_SMALLPADS]  76.75,77.56 180 bottom
JP202  [JP2_SMALLPADS]  96.7,58.75 180 bottom
JP203  [JP2_SMALLPADS]  46.02,86.45 0 bottom
JP204  [JP2_SMALLPADS]  76.75,83.4 180 bottom
JP205  JP2E_ORIG  [JP2_ORIG_SMALLPADS]  76.75,72.74 180 bottom
JP301  [JP2_SMALLPADS]  76.75,130.16 180 bottom
JP302  [JP2_SMALLPADS]  96.7,111.35 180 bottom
JP303  [JP2_SMALLPADS]  46.02,139.05 0 bottom
JP304  [JP2_SMALLPADS]  76.75,136 180 bottom
JP305  JP2E_ORIG  [JP2_ORIG_SMALLPADS]  76.75,125.34 180 bottom
JP401  [JP2_SMALLPADS]  172.75,24.96 180 bottom
JP402  [JP2_SMALLPADS]  192.7,6.15 180 bottom
JP403  [JP2_SMALLPADS]  142.02,33.85 0 bottom
JP404  [JP2_SMALLPADS]  172.75,30.8 180 bottom
JP405  JP2E_ORIG  [JP2_ORIG_SMALLPADS]  172.75,20.14 180 bottom
JP501  [JP2_SMALLPADS]  172.75,77.56 180 bottom
JP502  [JP2_SMALLPADS]  192.7,58.75 180 bottom
JP503  [JP2_SMALLPADS]  142.02,86.45 0 bottom
JP504  [JP2_SMALLPADS]  172.75,83.4 180 bottom
JP505  JP2E_ORIG  [JP2_ORIG_SMALLPADS]  172.75,72.74 180 bottom
JP601  [JP2_SMALLPADS]  172.75,130.16 180 bottom
JP602  [JP2_SMALLPADS]  192.7,111.35 180 bottom
JP603  [JP2_SMALLPADS]  142.02,139.05 0 bottom
JP604  [JP2_SMALLPADS]  172.75,136 180 bottom
JP605  JP2E_ORIG  [JP2_ORIG_SMALLPADS]  172.75,125.34 180 bottom
LED1  [LD260]  43.48,168.35 0 bottom
LED2  [LD260]  43.48,171.85 0 bottom
LED3  [LD260]  43.48,175.35 0 bottom
LED4  [LD260]  43.48,178.85 0 bottom
LED5  [LD260]  43.48,185.85 0 bottom
LED6  [LD260]  43.48,189.22 0 bottom
LED7  [LD260]  43.48,220.95 0 bottom
LED8  [LD260]  43.48,224.45 0 bottom
LED9  [LD260]  43.48,227.95 0 bottom
LED10  [LD260]  43.48,231.45 0 bottom
LED11  [LD260]  43.48,238.45 0 bottom
LED12  [LD260]  43.48,241.82 0 bottom
LED13  [LD260]  43.48,273.55 0 bottom
LED14  [LD260]  43.48,277.05 0 bottom
LED15  [LD260]  43.48,280.55 0 bottom
LED16  [LD260]  43.48,284.05 0 bottom
LED17  [LD260]  43.48,291.05 0 bottom
LED18  [LD260]  43.48,294.42 0 bottom
LED19  [LD260]  139.48,168.35 0 bottom
LED20  [LD260]  139.48,171.85 0 bottom
LED21  [LD260]  139.48,175.35 0 bottom
LED22  [LD260]  139.48,178.85 0 bottom
LED23  [LD260]  139.48,185.85 0 bottom
LED24  [LD260]  139.48,189.22 0 bottom
LED25  [LD260]  139.48,220.95 0 bottom
LED26  [LD260]  139.48,224.45 0 bottom
LED27  [LD260]  139.48,227.95 0 bottom
LED28  [LD260]  139.48,231.45 0 bottom
LED29  [LD260]  139.48,238.45 0 bottom
LED30  [LD260]  139.48,241.82 0 bottom
LED31  [LD260]  139.48,273.55 0 bottom
LED32  [LD260]  139.48,277.05 0 bottom
LED33  [LD260]  139.48,280.55 0 bottom
LED34  [LD260]  139.48,284.05 0 bottom
LED35  [LD260]  139.48,291.05 0 bottom
LED36  [LD260]  139.48,294.42 0 bottom
LED101  [LD260]  43.48,28.05 0 bottom
LED102  [LD260]  43.48,10.55 0 bottom
LED103  [LD260]  43.48,14.05 0 bottom
LED104  [LD260]  43.48,17.55 0 bottom
LED105  [LD260]  43.48,21.05 0 bottom
LED106  [LD260]  43.48,31.42 0 bottom
LED201  [LD260]  43.48,80.65 0 bottom
LED202  [LD260]  43.48,63.15 0 bottom
LED203  [LD260]  43.48,66.65 0 bottom
LED204  [LD260]  43.48,70.15 0 bottom
LED205  [LD260]  43.48,73.65 0 bottom
LED206  [LD260]  43.48,84.02 0 bottom
LED301  [LD260]  43.48,133.25 0 bottom
LED302  [LD260]  43.48,115.75 0 bottom
LED303  [LD260]  43.48,119.25 0 bottom
LED304  [LD260]  43.48,122.75 0 bottom
LED305  [LD260]  43.48,126.25 0 bottom
LED306  [LD260]  43.48,136.62 0 bottom
LED401  [LD260]  139.48,28.05 0 bottom
LED402  [LD260]  139.48,10.55 0 bottom
LED403  [LD260]  139.48,14.05 0 bottom
LED404  [LD260]  139.48,17.55 0 bottom
LED405  [LD260]  139.48,21.05 0 bottom
LED406  [LD260]  139.48,31.42 0 bottom
LED501  [LD260]  139.48,80.65 0 bottom
LED502  [LD260]  139.48,63.15 0 bottom
LED503  [LD260]  139.48,66.65 0 bottom
LED504  [LD260]  139.48,70.15 0 bottom
LED505  [LD260]  139.48,73.65 0 bottom
LED506  [LD260]  139.48,84.02 0 bottom
LED601  [LD260]  139.48,133.25 0 bottom
LED602  [LD260]  139.48,115.75 0 bottom
LED603  [LD260]  139.48,119.25 0 bottom
LED604  [LD260]  139.48,122.75 0 bottom
LED605  [LD260]  139.48,126.25 0 bottom
LED606  [LD260]  139.48,136.62 0 bottom
Q1  BA  [SOT89]  97.96,179.97 90 top
Q2  BA.  [SOT89]  19.35,161.93 90 top
Q3  BA.  [SOT89]  32.3,161.68 90 top
Q4  BA  [SOT89]  53.38,201.81 90 top
Q5  MY  [SOT89]  70.66,174 180 top
Q6  J1  [SOT-23]  83.48,176.29 270 top
Q7  J1  [SOT-23]  18.46,189.62 270 top
Q8  BA  [SOT89]  97.96,232.57 90 top
Q9  BA.  [SOT89]  19.35,214.53 90 top
Q10  BA.  [SOT89]  32.3,214.28 90 top
Q11  BA  [SOT89]  53.38,254.41 90 top
Q12  MY  [SOT89]  70.66,226.6 180 top
Q13  J1  [SOT-23]  83.48,228.89 270 top
Q14  J1  [SOT-23]  18.46,242.22 270 top
Q15  BA  [SOT89]  97.96,285.17 90 top
Q16  BA.  [SOT89]  19.35,267.13 90 top
Q17  BA.  [SOT89]  32.3,266.88 90 top
Q18  BA  [SOT89]  53.38,307.01 90 top
Q19  MY  [SOT89]  70.66,279.2 180 top
Q20  J1  [SOT-23]  83.48,281.49 270 top
Q21  J1  [SOT-23]  18.46,294.82 270 top
Q22  BA  [SOT89]  193.96,179.97 90 top
Q23  BA.  [SOT89]  115.35,161.93 90 top
Q24  BA.  [SOT89]  128.3,161.68 90 top
Q25  BA  [SOT89]  149.38,201.81 90 top
Q26  MY  [SOT89]  166.66,174 180 top
Q27  J1  [SOT-23]  179.48,176.29 270 top
Q28  J1  [SOT-23]  114.46,189.62 270 top
Q29  BA  [SOT89]  193.96,232.57 90 top
Q30  BA.  [SOT89]  115.35,214.53 90 top
Q31  BA.  [SOT89]  128.3,214.28 90 top
Q32  BA  [SOT89]  149.38,254.41 90 top
Q33  MY  [SOT89]  166.66,226.6 180 top
Q34  J1  [SOT-23]  179.48,228.89 270 top
Q35  J1  [SOT-23]  114.46,242.22 270 top
Q36  BA  [SOT89]  193.96,285.17 90 top
Q37  BA.  [SOT89]  115.35,267.13 90 top
Q38  BA.  [SOT89]  128.3,266.88 90 top
Q39  BA  [SOT89]  149.38,307.01 90 top
Q40  MY  [SOT89]  166.66,279.2 180 top
Q41  J1  [SOT-23]  179.48,281.49 270 top
Q42  J1  [SOT-23]  114.46,294.82 270 top
Q101  BA.  [SOT89]  32.3,3.88 90 top
Q102  BA.  [SOT89]  19.35,4.13 90 top
Q103  MY  [SOT89]  70.66,16.2 180 top
Q104  BA  [SOT89]  97.96,22.17 90 top
Q105  BA  [SOT89]  53.38,44.01 90 top
Q106  J1  [SOT-23]  18.46,31.82 270 top
Q107  J1  [SOT-23]  83.48,18.48 270 top
Q201  BA.  [SOT89]  32.3,56.48 90 top
Q202  BA.  [SOT89]  19.35,56.73 90 top
Q203  MY  [SOT89]  70.66,68.8 180 top
Q204  BA  [SOT89]  97.96,74.77 90 top
Q205  BA  [SOT89]  53.38,96.61 90 top
Q206  J1  [SOT-23]  18.46,84.42 270 top
Q207  J1  [SOT-23]  83.48,71.08 270 top
Q301  BA.  [SOT89]  32.3,109.08 90 top
Q302  BA.  [SOT89]  19.35,109.33 90 top
Q303  MY  [SOT89]  70.66,121.4 180 top
Q304  BA  [SOT89]  97.96,127.37 90 top
Q305  BA  [SOT89]  53.38,149.21 90 top
Q306  J1  [SOT-23]  18.46,137.02 270 top
Q307  J1  [SOT-23]  83.48,123.69 270 top
Q401  BA.  [SOT89]  128.3,3.88 90 top
Q402  BA.  [SOT89]  115.35,4.13 90 top
Q403  MY  [SOT89]  166.66,16.2 180 top
Q404  BA  [SOT89]  193.96,22.17 90 top
Q405  BA  [SOT89]  149.38,44.01 90 top
Q406  J1  [SOT-23]  114.46,31.82 270 top
Q407  J1  [SOT-23]  179.48,18.48 270 top
Q501  BA.  [SOT89]  128.3,56.48 90 top
Q502  BA.  [SOT89]  115.35,56.73 90 top
Q503  MY  [SOT89]  166.66,68.8 180 top
Q504  BA  [SOT89]  193.96,74.77 90 top
Q505  BA  [SOT89]  149.38,96.61 90 top
Q506  J1  [SOT-23]  114.46,84.42 270 top
Q507  J1  [SOT-23]  179.48,71.08 270 top
Q601  BA.  [SOT89]  128.3,109.08 90 top
Q602  BA.  [SOT89]  115.35,109.33 90 top
Q603  MY  [SOT89]  166.66,121.4 180 top
Q604  BA  [SOT89]  193.96,127.37 90 top
Q605  BA  [SOT89]  149.38,149.21 90 top
Q606  J1  [SOT-23]  114.46,137.02 270 top
Q607  J1  [SOT-23]  179.48,123.69 270 top
R1  47  [V235/17_1MM]  102.15,176.41 90 bottom
R2  13  [R1206]  56.3,195.46 180 top
R3  47  [V235/17_1MM]  102.15,196.29 90 bottom
R4  104  [R0805]  99.23,201.3 90 top
R5  104  [R0805]  99.23,198 90 top
R6  104  [R0805]  99.23,194.7 90 top
R7  4701  [R0805]  71.93,162.19 270 top
R8  1002  [R0805]  76.5,162.19 90 top
R9  1002  [R0805]  57.7,186.95 180 top
R10  1502  [R0805]  53,161.43 0 top
R11  104  [R0805]  52.05,178.06 270 top
R12  104  [R0805]  56.75,178.06 270 top
R13  1502  [R0805]  49.7,170.06 180 top
R14  1002  [R0805]  47.03,171.4 180 top
R15  2201  [R0805]  47.03,175.97 0 top
R16  1002  [R0805]  53.45,175.84 270 top
R17  4701  [R0805]  58.72,182.13 0 top
R18  2702  [R0805]  60.88,161.43 180 top
R19  102  [R0805]  12.36,166.63 270 top
R20  100  [R0805]  61.51,172.6 0 top
R21  (101)  [R0805]  37.51,182.89 270 top
R22  (1000)  [R0805]  47.03,166.76 0 top
R23  102  [R0805]  92.88,176.67 90 top
R24  13  [R1206]  23.16,171.84 180 top
R25  13  [R1206]  26.71,167.52 180 top
R26  2702  [R0805]  55.54,161.43 0 top
R27  4701  [R0805]  75.48,174.38 270 top
R28  100  [R0805]  82.98,179.71 90 top
R29  (101)  [R0805]  82.98,182.89 90 top
R30  104  [R0805]  78.53,180.35 270 top
R31  104  [R0805]  82.34,193.43 270 top
R32  (1002)  [R0805]  69.77,197.37 0 top
R33  2702  [R0805]  71.42,188.48 270 top
R34  47  [V235/17_1MM]  96.56,176.92 90 bottom
R35  47  [V235/17_1MM]  96.56,196.8 270 bottom
R36  2702  [R0805]  78.78,195.21 270 top
R37  2201  [R0805]  70.4,182.76 90 top
R38  (1002)  [R0805]  37,206.64 90 top
R39  1002  [R0805]  82.09,168.28 270 top
R40  102  [R0805]  82.09,171.33 270 top
R41  2702  [R0805]  79.55,174.38 90 top
R42  102  [R0805]  71.67,168.28 90 top
R43  102  [R0805]  71.67,165.24 90 top
R44  13  [R1206]  70.41,179.46 180 top
R45  R_user  [R0805']  17.07,171.59 180 top
R46  47  [V235/17_1MM]  102.15,229.01 90 bottom
R47  13  [R1206]  56.3,248.06 180 top
R48  47  [V235/17_1MM]  102.15,248.89 90 bottom
R49  104  [R0805]  99.23,253.9 90 top
R50  104  [R0805]  99.23,250.6 90 top
R51  104  [R0805]  99.23,247.3 90 top
R52  4701  [R0805]  71.93,214.79 270 top
R53  1002  [R0805]  76.5,214.79 90 top
R54  1002  [R0805]  57.7,239.55 180 top
R55  1502  [R0805]  53,214.03 0 top
R56  104  [R0805]  52.05,230.66 270 top
R57  104  [R0805]  56.75,230.66 270 top
R58  1502  [R0805]  49.7,222.66 180 top
R59  1002  [R0805]  47.03,224 180 top
R60  2201  [R0805]  47.03,228.57 0 top
R61  1002  [R0805]  53.45,228.44 270 top
R62  4701  [R0805]  58.72,234.73 0 top
R63  2702  [R0805]  60.88,214.03 180 top
R64  102  [R0805]  12.36,219.23 270 top
R65  100  [R0805]  61.51,225.2 0 top
R66  (101)  [R0805]  37.51,235.49 270 top
R67  (1000)  [R0805]  47.03,219.36 0 top
R68  102  [R0805]  92.88,229.27 90 top
R69  13  [R1206]  23.16,224.44 180 top
R70  13  [R1206]  26.71,220.12 180 top
R71  2702  [R0805]  55.54,214.03 0 top
R72  4701  [R0805]  75.48,226.98 270 top
R73  100  [R0805]  82.98,232.31 90 top
R74  (101)  [R0805]  82.98,235.49 90 top
R75  104  [R0805]  78.53,232.95 270 top
R76  104  [R0805]  82.34,246.03 270 top
R77  (1002)  [R0805]  69.77,249.97 0 top
R78  2702  [R0805]  71.42,241.08 270 top
R79  47  [V235/17_1MM]  96.56,229.52 90 bottom
R80  47  [V235/17_1MM]  96.56,249.4 270 bottom
R81  2702  [R0805]  78.78,247.81 270 top
R82  2201  [R0805]  70.4,235.36 90 top
R83  (1002)  [R0805]  37,259.24 90 top
R84  1002  [R0805]  82.09,220.88 270 top
R85  102  [R0805]  82.09,223.93 270 top
R86  2702  [R0805]  79.55,226.98 90 top
R87  102  [R0805]  71.67,220.88 90 top
R88  102  [R0805]  71.67,217.84 90 top
R89  13  [R1206]  70.41,232.06 180 top
R90  R_user  [R0805']  17.07,224.19 180 top
R91  47  [V235/17_1MM]  102.15,281.61 90 bottom
R92  13  [R1206]  56.3,300.66 180 top
R93  47  [V235/17_1MM]  102.15,301.49 90 bottom
R94  104  [R0805]  99.23,306.5 90 top
R95  104  [R0805]  99.23,303.2 90 top
R96  104  [R0805]  99.23,299.9 90 top
R97  4701  [R0805]  71.93,267.39 270 top
R98  1002  [R0805]  76.5,267.39 90 top
R99  1002  [R0805]  57.7,292.15 180 top
R100  1502  [R0805]  53,266.63 0 top
R101  102  [R0805]  12.36,8.83 270 top
R102  13  [R1206]  26.71,9.72 180 top
R103  R_user  [R0805']  17.07,13.79 180 top
R104  104  [R0805]  52.05,283.26 270 top
R105  4701  [R0805]  71.93,4.39 270 top
R106  13  [R1206]  23.16,14.04 180 top
R107  1002  [R0805]  76.5,4.39 90 top
R108  1002  [R0805]  82.09,10.48 270 top
R109  104  [R0805]  99.23,43.5 90 top
R110  104  [R0805]  99.23,40.2 90 top
R111  104  [R0805]  99.23,36.9 90 top
R112  102  [R0805]  82.09,13.53 270 top
R113  102  [R0805]  71.67,10.48 90 top
R114  102  [R0805]  71.67,7.44 90 top
R115  100  [R0805]  61.51,14.8 0 top
R116  4701  [R0805]  75.48,16.58 270 top
R117  2702  [R0805]  79.55,16.58 90 top
R118  13  [R1206]  70.41,21.66 180 top
R119  2201  [R0805]  70.4,24.96 90 top
R120  1002  [R0805]  57.7,29.15 180 top
R121  1502  [R0805]  53,3.63 0 top
R122  2702  [R0805]  55.54,3.63 0 top
R123  2702  [R0805]  60.88,3.63 180 top
R124  1002  [R0805]  53.45,18.04 270 top
R125  104  [R0805]  52.05,20.26 270 top
R126  4701  [R0805]  58.72,24.33 0 top
R127  47  [V235/17_1MM]  102.15,18.61 90 bottom
R128  102  [R0805]  92.88,18.87 90 top
R129  47  [V235/17_1MM]  102.15,38.49 90 bottom
R130  104  [R0805]  56.75,20.26 270 top
R131  1502  [R0805]  49.7,12.26 180 top
R132  1002  [R0805]  47.03,13.6 180 top
R133  2201  [R0805]  47.03,18.17 0 top
R134  13  [R1206]  56.3,37.66 180 top
R135  104  [R0805]  78.53,22.55 270 top
R136  47  [V235/17_1MM]  96.56,19.12 90 bottom
R137  47  [V235/17_1MM]  96.56,39 270 bottom
R138  100  [R0805]  82.98,21.91 90 top
R139  (101)  [R0805]  82.98,25.09 90 top
R140  2702  [R0805]  71.42,30.68 270 top
R141  104  [R0805]  82.34,35.63 270 top
R142  (1000)  [R0805]  47.03,8.96 0 top
R143  (101)  [R0805]  37.51,25.09 270 top
R144  (1002)  [R0805]  69.77,39.57 0 top
R145  2702  [R0805]  78.78,37.41 270 top
R146  (1002)  [R0805]  37,48.84 90 top
R147  104  [R0805]  56.75,283.26 270 top
R148  1502  [R0805]  49.7,275.26 180 top
R149  1002  [R0805]  47.03,276.6 180 top
R150  2201  [R0805]  47.03,281.17 0 top
R151  1002  [R0805]  53.45,281.04 270 top
R152  4701  [R0805]  58.72,287.33 0 top
R153  2702  [R0805]  60.88,266.63 180 top
R154  102  [R0805]  12.36,271.83 270 top
R155  100  [R0805]  61.51,277.8 0 top
R156  (101)  [R0805]  37.51,288.09 270 top
R157  (1000)  [R0805]  47.03,271.96 0 top
R158  102  [R0805]  92.88,281.87 90 top
R159  13  [R1206]  23.16,277.04 180 top
R160  13  [R1206]  26.71,272.72 180 top
R161  2702  [R0805]  55.54,266.63 0 top
R162  4701  [R0805]  75.48,279.58 270 top
R163  100  [R0805]  82.98,284.91 90 top
R164  (101)  [R0805]  82.98,288.09 90 top
R165  104  [R0805]  78.53,285.55 270 top
R166  104  [R0805]  82.34,298.63 270 top
R167  (1002)  [R0805]  69.77,302.57 0 top
R168  2702  [R0805]  71.42,293.68 270 top
R169  47  [V235/17_1MM]  96.56,282.12 90 bottom
R170  47  [V235/17_1MM]  96.56,302 270 bottom
R171  2702  [R0805]  78.78,300.41 270 top
R172  2201  [R0805]  70.4,287.96 90 top
R173  (1002)  [R0805]  37,311.84 90 top
R174  1002  [R0805]  82.09,273.48 270 top
R175  102  [R0805]  82.09,276.53 270 top
R176  2702  [R0805]  79.55,279.58 90 top
R177  102  [R0805]  71.67,273.48 90 top
R178  102  [R0805]  71.67,270.44 90 top
R179  13  [R1206]  70.41,284.66 180 top
R180  R_user  [R0805']  17.07,276.79 180 top
R181  47  [V235/17_1MM]  198.15,176.41 90 bottom
R182  13  [R1206]  152.3,195.46 180 top
R183  47  [V235/17_1MM]  198.15,196.29 90 bottom
R184  104  [R0805]  195.23,201.3 90 top
R185  104  [R0805]  195.23,198 90 top
R186  104  [R0805]  195.23,194.7 90 top
R187  4701  [R0805]  167.93,162.19 270 top
R188  1002  [R0805]  172.5,162.19 90 top
R189  1002  [R0805]  153.7,186.95 180 top
R190  1502  [R0805]  149,161.43 0 top
R191  104  [R0805]  148.05,178.06 270 top
R192  104  [R0805]  152.75,178.06 270 top
R193  1502  [R0805]  145.7,170.06 180 top
R194  1002  [R0805]  143.03,171.4 180 top
R195  2201  [R0805]  143.03,175.97 0 top
R196  1002  [R0805]  149.45,175.84 270 top
R197  4701  [R0805]  154.72,182.13 0 top
R198  2702  [R0805]  156.88,161.43 180 top
R199  102  [R0805]  108.36,166.63 270 top
R200  100  [R0805]  157.51,172.6 0 top
R201  102  [R0805]  12.36,61.43 270 top
R202  13  [R1206]  26.71,62.32 180 top
R203  R_user  [R0805']  17.07,66.39 180 top
R204  (101)  [R0805]  133.51,182.89 270 top
R205  4701  [R0805]  71.93,56.99 270 top
R206  13  [R1206]  23.16,66.64 180 top
R207  1002  [R0805]  76.5,56.99 90 top
R208  1002  [R0805]  82.09,63.08 270 top
R209  104  [R0805]  99.23,96.1 90 top
R210  104  [R0805]  99.23,92.8 90 top
R211  104  [R0805]  99.23,89.5 90 top
R212  102  [R0805]  82.09,66.13 270 top
R213  102  [R0805]  71.67,63.08 90 top
R214  102  [R0805]  71.67,60.04 90 top
R215  100  [R0805]  61.51,67.4 0 top
R216  4701  [R0805]  75.48,69.18 270 top
R217  2702  [R0805]  79.55,69.18 90 top
R218  13  [R1206]  70.41,74.26 180 top
R219  2201  [R0805]  70.4,77.56 90 top
R220  1002  [R0805]  57.7,81.75 180 top
R221  1502  [R0805]  53,56.23 0 top
R222  2702  [R0805]  55.54,56.23 0 top
R223  2702  [R0805]  60.88,56.23 180 top
R224  1002  [R0805]  53.45,70.64 270 top
R225  104  [R0805]  52.05,72.86 270 top
R226  4701  [R0805]  58.72,76.93 0 top
R227  47  [V235/17_1MM]  102.15,71.21 90 bottom
R228  102  [R0805]  92.88,71.47 90 top
R229  47  [V235/17_1MM]  102.15,91.09 90 bottom
R230  104  [R0805]  56.75,72.86 270 top
R231  1502  [R0805]  49.7,64.86 180 top
R232  1002  [R0805]  47.03,66.2 180 top
R233  2201  [R0805]  47.03,70.77 0 top
R234  13  [R1206]  56.3,90.26 180 top
R235  104  [R0805]  78.53,75.15 270 top
R236  47  [V235/17_1MM]  96.56,71.72 90 bottom
R237  47  [V235/17_1MM]  96.56,91.6 270 bottom
R238  100  [R0805]  82.98,74.51 90 top
R239  (101)  [R0805]  82.98,77.69 90 top
R240  2702  [R0805]  71.42,83.28 270 top
R241  104  [R0805]  82.34,88.23 270 top
R242  (1000)  [R0805]  47.03,61.56 0 top
R243  (101)  [R0805]  37.51,77.69 270 top
R244  (1002)  [R0805]  69.77,92.17 0 top
R245  2702  [R0805]  78.78,90.01 270 top
R246  (1002)  [R0805]  37,101.44 90 top
R247  (1000)  [R0805]  143.03,166.76 0 top
R248  102  [R0805]  188.88,176.67 90 top
R249  13  [R1206]  119.16,171.84 180 top
R250  13  [R1206]  122.71,167.52 180 top
R251  2702  [R0805]  151.54,161.43 0 top
R252  4701  [R0805]  171.48,174.38 270 top
R253  100  [R0805]  178.97,179.71 90 top
R254  (101)  [R0805]  178.97,182.89 90 top
R255  104  [R0805]  174.53,180.35 270 top
R256  104  [R0805]  178.34,193.43 270 top
R257  (1002)  [R0805]  165.77,197.37 0 top
R258  2702  [R0805]  167.42,188.48 270 top
R259  47  [V235/17_1MM]  192.56,176.92 90 bottom
R260  47  [V235/17_1MM]  192.56,196.8 270 bottom
R261  2702  [R0805]  174.78,195.21 270 top
R262  2201  [R0805]  166.4,182.76 90 top
R263  (1002)  [R0805]  133,206.64 90 top
R264  1002  [R0805]  178.09,168.28 270 top
R265  102  [R0805]  178.09,171.33 270 top
R266  2702  [R0805]  175.55,174.38 90 top
R267  102  [R0805]  167.67,168.28 90 top
R268  102  [R0805]  167.67,165.24 90 top
R269  13  [R1206]  166.41,179.46 180 top
R270  R_user  [R0805']  113.07,171.59 180 top
R271  47  [V235/17_1MM]  198.15,229.01 90 bottom
R272  13  [R1206]  152.3,248.06 180 top
R273  47  [V235/17_1MM]  198.15,248.89 90 bottom
R274  104  [R0805]  195.23,253.9 90 top
R275  104  [R0805]  195.23,250.6 90 top
R276  104  [R0805]  195.23,247.3 90 top
R277  4701  [R0805]  167.93,214.79 270 top
R278  1002  [R0805]  172.5,214.79 90 top
R279  1002  [R0805]  153.7,239.55 180 top
R280  1502  [R0805]  149,214.03 0 top
R281  104  [R0805]  148.05,230.66 270 top
R282  104  [R0805]  152.75,230.66 270 top
R283  1502  [R0805]  145.7,222.66 180 top
R284  1002  [R0805]  143.03,224 180 top
R285  2201  [R0805]  143.03,228.57 0 top
R286  1002  [R0805]  149.45,228.44 270 top
R287  4701  [R0805]  154.72,234.73 0 top
R288  2702  [R0805]  156.88,214.03 180 top
R289  102  [R0805]  108.36,219.23 270 top
R290  100  [R0805]  157.51,225.2 0 top
R291  (101)  [R0805]  133.51,235.49 270 top
R292  (1000)  [R0805]  143.03,219.36 0 top
R293  102  [R0805]  188.88,229.27 90 top
R294  13  [R1206]  119.16,224.44 180 top
R295  13  [R1206]  122.71,220.12 180 top
R296  2702  [R0805]  151.54,214.03 0 top
R297  4701  [R0805]  171.48,226.98 270 top
R298  100  [R0805]  178.97,232.31 90 top
R299  (101)  [R0805]  178.97,235.49 90 top
R300  104  [R0805]  174.53,232.95 270 top
R301  102  [R0805]  12.36,114.03 270 top
R302  13  [R1206]  26.71,114.92 180 top
R303  R_user  [R0805']  17.07,118.99 180 top
R304  104  [R0805]  178.34,246.03 270 top
R305  4701  [R0805]  71.93,109.59 270 top
R306  13  [R1206]  23.16,119.24 180 top
R307  1002  [R0805]  76.5,109.59 90 top
R308  1002  [R0805]  82.09,115.68 270 top
R309  104  [R0805]  99.23,148.7 90 top
R310  104  [R0805]  99.23,145.4 90 top
R311  104  [R0805]  99.23,142.1 90 top
R312  102  [R0805]  82.09,118.73 270 top
R313  102  [R0805]  71.67,115.68 90 top
R314  102  [R0805]  71.67,112.64 90 top
R315  100  [R0805]  61.51,120 0 top
R316  4701  [R0805]  75.48,121.78 270 top
R317  2702  [R0805]  79.55,121.78 90 top
R318  13  [R1206]  70.41,126.86 180 top
R319  2201  [R0805]  70.4,130.16 90 top
R320  1002  [R0805]  57.7,134.35 180 top
R321  1502  [R0805]  53,108.83 0 top
R322  2702  [R0805]  55.54,108.83 0 top
R323  2702  [R0805]  60.88,108.83 180 top
R324  1002  [R0805]  53.45,123.24 270 top
R325  104  [R0805]  52.05,125.46 270 top
R326  4701  [R0805]  58.72,129.53 0 top
R327  47  [V235/17_1MM]  102.15,123.81 90 bottom
R328  102  [R0805]  92.88,124.07 90 top
R329  47  [V235/17_1MM]  102.15,143.69 90 bottom
R330  104  [R0805]  56.75,125.46 270 top
R331  1502  [R0805]  49.7,117.46 180 top
R332  1002  [R0805]  47.03,118.8 180 top
R333  2201  [R0805]  47.03,123.37 0 top
R334  13  [R1206]  56.3,142.86 180 top
R335  104  [R0805]  78.53,127.75 270 top
R336  47  [V235/17_1MM]  96.56,124.32 90 bottom
R337  47  [V235/17_1MM]  96.56,144.2 270 bottom
R338  100  [R0805]  82.98,127.11 90 top
R339  (101)  [R0805]  82.98,130.29 90 top
R340  2702  [R0805]  71.42,135.88 270 top
R341  104  [R0805]  82.34,140.83 270 top
R342  (1000)  [R0805]  47.03,114.16 0 top
R343  (101)  [R0805]  37.51,130.29 270 top
R344  (1002)  [R0805]  69.77,144.77 0 top